# Altium schematic sheet Master MicroController Port G.SchDoc: Master Micro Controller Port G Pin Out
size A4; DocumentNumber: 22; SheetNumber: 22; SheetTotal: 54
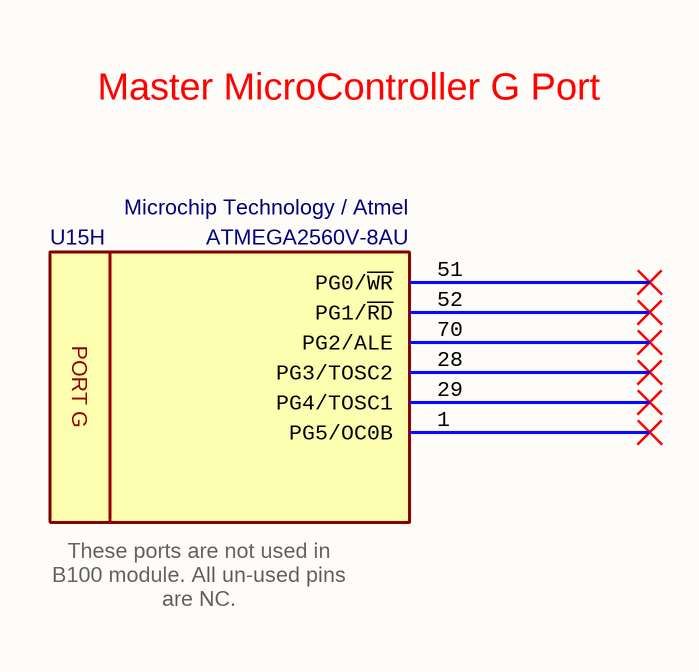
[diagram p0: Master MicroController Port G.SchDoc]

## Parts
U15  Manufacturer_Part_Number: ATMEGA2560V-8AU  Manufacturer_Name: Microchip Technology / Atmel  [TQFP100]  (hidden comment: 8-bit MicroController)  (part H of 15)

## Nets

Not connected (* = marked no-connect by the designer): U15 1(PG5/OC0B)* 28(PG3/TOSC2)* 29(PG4/TOSC1)* 51(PG0/~{WR})* 52(PG1/~{RD})* 70(PG2/ALE)*

## Notes on the sheet
- Master MicroController G Port
- These ports are not used in B100 module. All un-used pins are NC.
- Engineer
- All Rights are reserved to Customer and Engineer. [2021]
- Size:
- Date:
- A4
- Project :
- Time:
- Sheet
- of
- Customer
- Product ID
- Module ID
- Version
- File:
- Revision
- (in symbol IC - ATMEGA2560V-8AU, part H) PORT G

## Library data of the parts
U15 = IC - ATMEGA2560V-8AU: 8-bit Microcontrollers - MCU 256kB Flash 4kB EEPROM 86 I/O Pins; Supply Voltage - Min: 2V7; Supply Voltage - Max: 5.5V; Height: 1mm; Mouser_Part_Number: 556-ATMEGA2560V8AU; ComponentLink1Description: DataSheet; ComponentLink1URL: https://eu.mouser.com/datasheet/2/268/Atmel-2549-8-bit-AVR-Microcontroller-ATmega640-128-1315286.pdf; ROHS: Yes; Minimum Operating Temperature: -40; Maximum Operating Temperature: +85; ComponentLink2Description: Mouser; ComponentLink2URL: https://eu.mouser.com/ProductDetail/Microchip-Technology-Atmel/ATMEGA2560V-8AU?qs=sGAEpiMZZMutXGli8Ay4kKlCYcvZUWqJYdtgGFyqFT8%3D; Supplier 1: Mouser; Supplier 2: Arrow; Supplier 3: Farnell; Supplier 4: Newark; Supplier 5: Digi-Key; Supplier Part Number 1: 556-ATMEGA2560V8AU; Supplier Part Number 2: ATMEGA2560V-8AU; Supplier Part Number 3: 1288331; Supplier Part Number 4: 68T2784; Supplier Part Number 5: ATMEGA2560V-8AU-ND; Case: TQFP-100